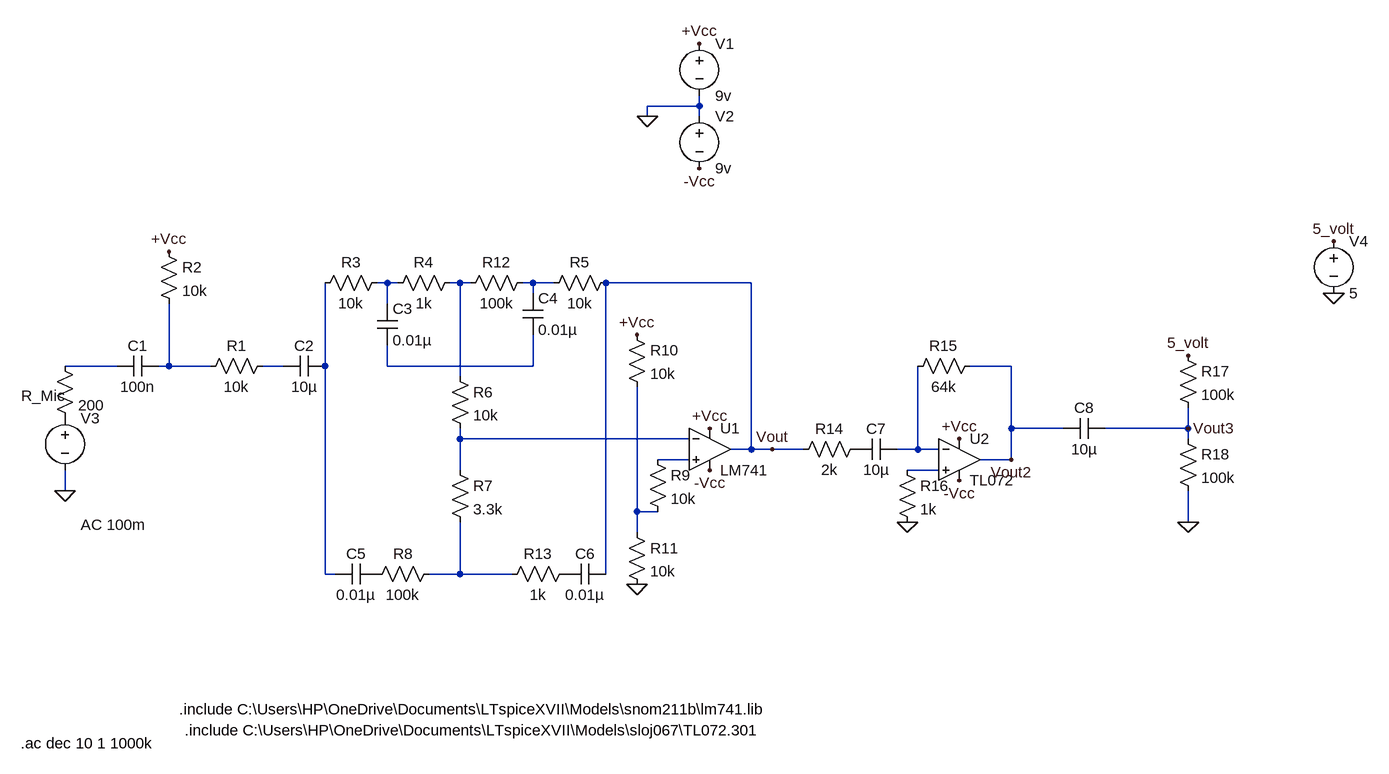
[diagram p0: schematic Preamp.asc]
Preamp.asc, the LTspice schematic file:
Version 4
SHEET 1 1720 680
WIRE 688 -400 688 -416
WIRE 688 -400 608 -400
WIRE 608 -384 608 -400
WIRE 688 -384 688 -400
WIRE 208 -128 192 -128
WIRE 224 -128 208 -128
WIRE 320 -128 304 -128
WIRE 336 -128 320 -128
WIRE 432 -128 416 -128
WIRE 464 -128 432 -128
WIRE 768 -128 544 -128
WIRE 432 -112 432 -128
WIRE 208 -96 208 -128
WIRE -208 0 -288 0
WIRE -128 0 -128 -96
WIRE -128 0 -144 0
WIRE -64 0 -128 0
WIRE 48 0 16 0
WIRE 112 0 112 -128
WIRE 208 0 208 -32
WIRE 432 0 432 -48
WIRE 432 0 208 0
WIRE 1168 0 1104 0
WIRE 320 16 320 -128
WIRE 1168 96 1168 0
WIRE 1248 96 1168 96
WIRE 1440 96 1440 64
WIRE 1440 96 1312 96
WIRE 320 112 320 96
WIRE 672 112 320 112
WIRE 1440 112 1440 96
WIRE 768 128 768 -128
WIRE 768 128 736 128
WIRE 800 128 768 128
WIRE 848 128 800 128
WIRE 1024 128 1024 0
WIRE 1024 128 992 128
WIRE 1056 128 1024 128
WIRE 672 144 624 144
WIRE 1168 144 1168 96
WIRE 1168 144 1120 144
WIRE 320 160 320 112
WIRE 1056 160 1008 160
WIRE -288 192 -288 160
WIRE 592 224 592 32
WIRE 624 224 592 224
WIRE 1440 240 1440 192
WIRE 592 256 592 224
WIRE 112 320 112 0
WIRE 128 320 112 320
WIRE 320 320 320 240
WIRE 320 320 272 320
WIRE 400 320 320 320
WIRE 544 320 544 -128
FLAG 688 -496 +Vcc
FLAG 704 96 +Vcc
FLAG 688 -304 -Vcc
FLAG 704 160 -Vcc
FLAG 800 128 Vout
FLAG -288 192 0
FLAG 592 336 0
FLAG -128 -176 +Vcc
FLAG 592 -48 +Vcc
FLAG 1088 112 +Vcc
FLAG 1088 176 -Vcc
FLAG 1168 144 Vout2
FLAG 1008 240 0
FLAG 608 -384 0
FLAG 1440 240 0
FLAG 1440 96 Vout3
FLAG 1664 -112 0
FLAG 1664 -192 5_volt
FLAG 1440 -16 5_volt
SYMBOL OpAmps\\opamp2 704 64 R0
SYMATTR InstName U1
SYMATTR Value LM741
SYMBOL voltage 688 -512 R0
WINDOW 123 0 0 Left 0
WINDOW 39 0 0 Left 0
SYMATTR InstName V1
SYMATTR Value 9v
SYMBOL voltage -288 64 R0
WINDOW 123 24 180 Left 2
WINDOW 39 0 0 Left 0
WINDOW 3 24 152 Left 2
SYMATTR Value2 AC 100m
SYMATTR Value ""
SYMATTR InstName V3
SYMBOL res -304 -16 R0
WINDOW 0 -51 62 Left 2
SYMATTR InstName R_Mic
SYMATTR Value 200
SYMBOL cap -144 -16 R90
WINDOW 0 0 32 VBottom 2
WINDOW 3 32 32 VTop 2
SYMATTR InstName C1
SYMATTR Value 100n
SYMBOL res 32 -16 R90
WINDOW 0 0 56 VBottom 2
WINDOW 3 32 56 VTop 2
SYMATTR InstName R1
SYMATTR Value 10k
SYMBOL res -144 -192 R0
SYMATTR InstName R2
SYMATTR Value 10k
SYMBOL cap 112 -16 R90
WINDOW 0 0 32 VBottom 2
WINDOW 3 32 32 VTop 2
SYMATTR InstName C2
SYMATTR Value 10µ
SYMBOL res 208 -144 R90
WINDOW 0 0 56 VBottom 2
WINDOW 3 32 56 VTop 2
SYMATTR InstName R3
SYMATTR Value 10k
SYMBOL res 320 -144 R90
WINDOW 0 0 56 VBottom 2
WINDOW 3 32 56 VTop 2
SYMATTR InstName R4
SYMATTR Value 1k
SYMBOL res 560 -144 R90
WINDOW 0 0 56 VBottom 2
WINDOW 3 32 56 VTop 2
SYMATTR InstName R5
SYMATTR Value 10k
SYMBOL cap 192 -96 R0
SYMATTR InstName C3
SYMATTR Value 0.01µ
SYMBOL cap 416 -112 R0
SYMATTR InstName C4
SYMATTR Value 0.01µ
SYMBOL res 304 0 R0
SYMATTR InstName R6
SYMATTR Value 10k
SYMBOL res 304 144 R0
SYMATTR InstName R7
SYMATTR Value 3.3k
SYMBOL res 288 304 R90
WINDOW 0 0 56 VBottom 2
WINDOW 3 32 56 VTop 2
SYMATTR InstName R8
SYMATTR Value 100k
SYMBOL cap 192 304 R90
WINDOW 0 0 32 VBottom 2
WINDOW 3 32 32 VTop 2
SYMATTR InstName C5
SYMATTR Value 0.01µ
SYMBOL cap 544 304 R90
WINDOW 0 0 32 VBottom 2
WINDOW 3 32 32 VTop 2
SYMATTR InstName C6
SYMATTR Value 0.01µ
SYMBOL res 608 128 R0
SYMATTR InstName R9
SYMATTR Value 10k
SYMBOL res 576 -64 R0
SYMATTR InstName R10
SYMATTR Value 10k
SYMBOL res 576 240 R0
SYMATTR InstName R11
SYMATTR Value 10k
SYMBOL res 432 -144 R90
WINDOW 0 0 56 VBottom 2
WINDOW 3 32 56 VTop 2
SYMATTR InstName R12
SYMATTR Value 100k
SYMBOL res 496 304 R90
WINDOW 0 0 56 VBottom 2
WINDOW 3 32 56 VTop 2
SYMATTR InstName R13
SYMATTR Value 1k
SYMBOL res 944 112 R90
WINDOW 0 0 56 VBottom 2
WINDOW 3 32 56 VTop 2
SYMATTR InstName R14
SYMATTR Value 2k
SYMBOL OpAmps\\opamp2 1088 80 R0
SYMATTR InstName U2
SYMATTR Value TL072
SYMBOL res 1120 -16 R90
WINDOW 0 0 56 VBottom 2
WINDOW 3 32 56 VTop 2
SYMATTR InstName R15
SYMATTR Value 64k
SYMBOL res 992 144 R0
SYMATTR InstName R16
SYMATTR Value 1k
SYMBOL voltage 688 -400 R0
WINDOW 123 0 0 Left 0
WINDOW 39 0 0 Left 0
SYMATTR InstName V2
SYMATTR Value 9v
SYMBOL res 1424 -32 R0
SYMATTR InstName R17
SYMATTR Value 100k
SYMBOL res 1424 96 R0
SYMATTR InstName R18
SYMATTR Value 100k
SYMBOL voltage 1664 -208 R0
WINDOW 123 0 0 Left 0
WINDOW 39 0 0 Left 0
SYMATTR InstName V4
SYMATTR Value 5
SYMBOL cap 1312 80 R90
WINDOW 0 0 32 VBottom 2
WINDOW 3 32 32 VTop 2
SYMATTR InstName C8
SYMATTR Value 10µ
SYMBOL cap 992 112 R90
WINDOW 0 0 32 VBottom 2
WINDOW 3 32 32 VTop 2
SYMATTR InstName C7
SYMATTR Value 10µ
TEXT -112 528 Left 2 !.include C:\\Users\\HP\\OneDrive\\Documents\\LTspiceXVII\\Models\\snom211b\\lm741.lib
TEXT -104 560 Left 2 !.include C:\\Users\\HP\\OneDrive\\Documents\\LTspiceXVII\\Models\\sloj067\\TL072.301
TEXT -356 580 Left 2 !.ac dec 10 1 1000k

The netlist it stands for:
* Preamp.asc
XU1 N011 N009 +Vcc -Vcc Vout LM741  ; pins In+ In- V+ V- OUT
V1 +Vcc 0 9v
V3 P001 0 AC 100m
R_Mic N004 P001 200
C1 N005 N004 100n
R1 N006 N005 10k
R2 +Vcc N005 10k
C2 N007 N006 10µ
R3 N001 N007 10k
R4 N002 N001 1k
R5 Vout N003 10k
C3 N001 N008 0.01µ
C4 N003 N008 0.01µ
R6 N002 N009 10k
R7 N009 N014 3.3k
R8 N014 P002 100k
C5 P002 N007 0.01µ
C6 Vout P003 0.01µ
R9 N011 N013 10k
R10 +Vcc N013 10k
R11 N013 0 10k
R12 N003 N002 100k
R13 P003 N014 1k
R14 P004 Vout 2k
XU2 N012 N010 +Vcc -Vcc Vout2 TL072  ; pins In+ In- V+ V- OUT
R15 Vout2 N010 64k
R16 N012 0 1k
V2 0 -Vcc 9v
R17 5_volt Vout3 100k
R18 Vout3 0 100k
V4 5_volt 0 5
C8 Vout3 Vout2 10µ
C7 N010 P004 10µ
.include C:\Users\HP\OneDrive\Documents\LTspiceXVII\Models\snom211b\lm741.lib
.include C:\Users\HP\OneDrive\Documents\LTspiceXVII\Models\sloj067\TL072.301
.ac dec 10 1 1000k
.backanno
.end